# Altium schematic sheet borneras.SchDoc
size A4; SheetNumber: 3; SheetTotal: 3
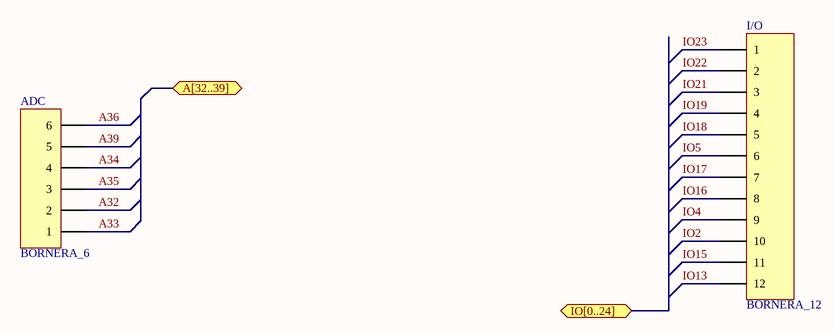
[diagram p0: borneras.SchDoc]

## Parts
ADC  BORNERA_6  [BORNERA_6]
I/O  BORNERA_12  [BORNERA_12]

## Ports
A[32..39] (bidir), IO[0..24] (bidir)

## Nets
A32: ADC.2
A33: ADC.1
A34: ADC.4
A35: ADC.3
A36: ADC.6
A39: ADC.5
IO2: I/O.10
IO4: I/O.9
IO5: I/O.6
IO13: I/O.12
IO15: I/O.11
IO16: I/O.8
IO17: I/O.7
IO18: I/O.5
IO19: I/O.4
IO21: I/O.3
IO22: I/O.2
IO23: I/O.1